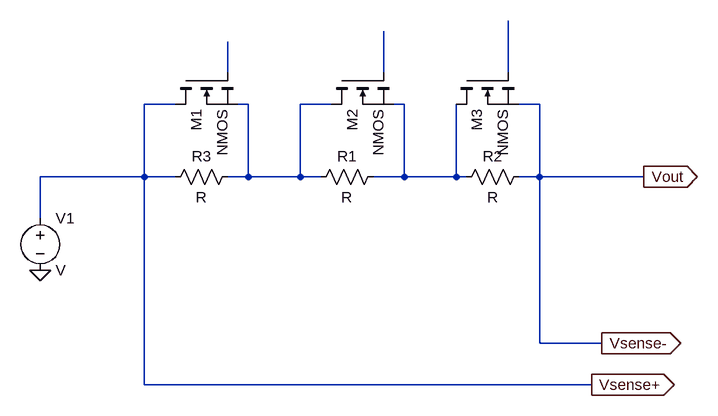
[diagram p0: schematic series_shunt_switch.asc]
series_shunt_switch.asc, the LTspice schematic file:
Version 4
SHEET 1 880 680
WIRE 48 -64 48 -112
WIRE 288 -64 288 -128
WIRE 480 -64 480 -144
WIRE -32 -16 -80 -16
WIRE 80 -16 64 -16
WIRE 208 -16 160 -16
WIRE 320 -16 304 -16
WIRE 528 -16 496 -16
WIRE -80 96 -80 -16
WIRE -80 96 -240 96
WIRE -32 96 -80 96
WIRE 80 96 80 -16
WIRE 80 96 48 96
WIRE 160 96 160 -16
WIRE 160 96 80 96
WIRE 192 96 160 96
WIRE 320 96 320 -16
WIRE 320 96 272 96
WIRE 400 96 400 -16
WIRE 400 96 320 96
WIRE 416 96 400 96
WIRE 528 96 528 -16
WIRE 528 96 496 96
WIRE 688 96 528 96
WIRE -240 160 -240 96
WIRE 528 352 528 96
WIRE 624 352 528 352
WIRE -80 416 -80 96
WIRE 608 416 -80 416
FLAG -240 240 0
FLAG 688 96 Vout
IOPIN 688 96 Out
FLAG 608 416 Vsense+
IOPIN 608 416 Out
FLAG 624 352 Vsense-
IOPIN 624 352 Out
SYMBOL voltage -240 144 R0
SYMATTR InstName V1
SYMBOL res 288 80 R90
WINDOW 0 0 56 VBottom 2
WINDOW 3 32 56 VTop 2
SYMATTR InstName R1
SYMBOL res 512 80 R90
WINDOW 0 0 56 VBottom 2
WINDOW 3 32 56 VTop 2
SYMATTR InstName R2
SYMBOL res 64 80 R90
WINDOW 0 0 56 VBottom 2
WINDOW 3 32 56 VTop 2
SYMATTR InstName R3
SYMBOL nmos -32 -64 M90
SYMATTR InstName M1
SYMBOL nmos 208 -64 M90
SYMATTR InstName M2
SYMBOL nmos 400 -64 M90
SYMATTR InstName M3

The netlist it stands for:
* series_shunt_switch.asc
V1 Vsense+ 0 V
R1 N005 N004 R
R2 Vsense- N005 R
R3 N004 Vsense+ R
M1 Vsense+ N001 N004 N004 NMOS
M2 N004 N002 N005 N005 NMOS
M3 N005 N003 Vsense- Vsense- NMOS
.model NMOS NMOS
.model PMOS PMOS
.lib standard.mos
.backanno
.end